# Altium project DMX8x8A-v1.PrjPcb
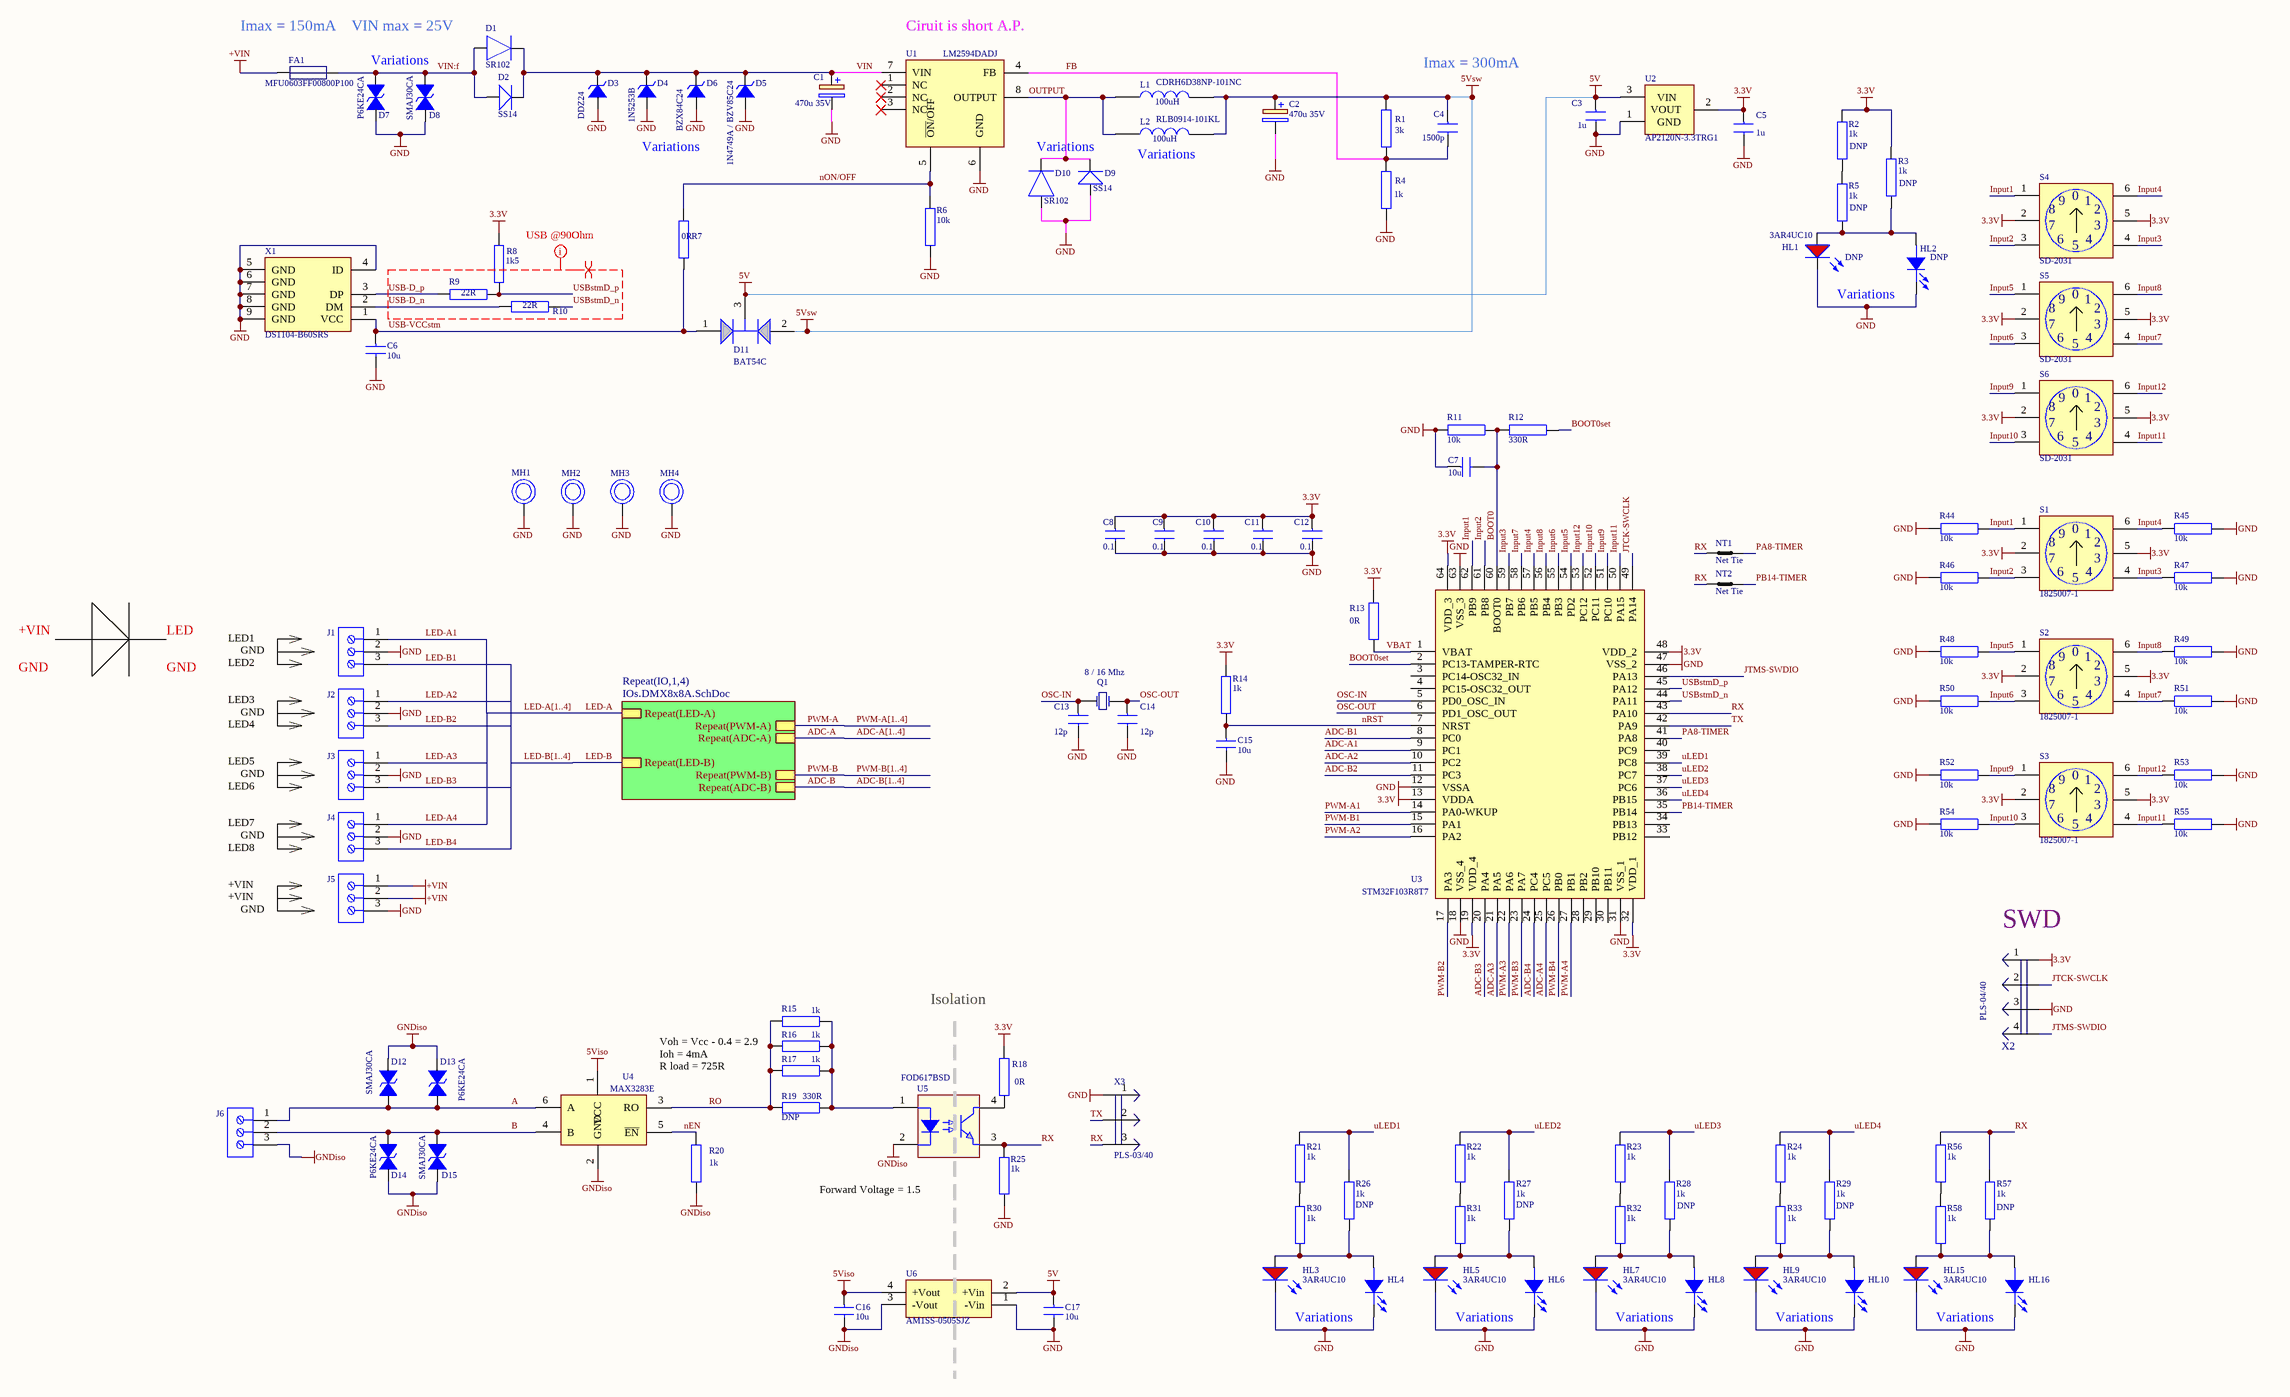
[diagram p0: Top.DMX8x8A-v1.SchDoc]
2 sheets, 255 parts. Net scope: hierarchical (ports join the sheet entries above them; power ports are global).
Board file: DMX8x8A-v1.PcbDoc
Sheets:
  Top.DMX8x8A-v1.SchDoc
    IO1 = IOs.DMX8x8A.SchDoc
    IO2 = IOs.DMX8x8A.SchDoc
    IO3 = IOs.DMX8x8A.SchDoc
    IO4 = IOs.DMX8x8A.SchDoc

## Sheet Top.DMX8x8A-v1.SchDoc: DMX8x8A-v1
size C; CheckedBy: Sitkin, Gilfanov; Author: Karabatov; CompanyName: GIKASIT; DrawnBy: Karabatov; Engineer: Karabatov; Organization: GIKASIT; Address1: 11 liniya V.O.; Address2: 32/44; Address3: Saint Petersburg; Address4: Russia; DocumentNumber: 1; SheetNumber: 1; SheetTotal: 2

### Parts
C1  value 470u 35V  [CAPPRD500W60D1025H1750]  (hidden comment: 35ZL470MEFC10X20)
C2  value 470u 35V  [CAPPRD500W60D1025H1750]  (hidden comment: 35ZL470MEFC10X20)
C3  value 1u  [Chip C 0402 - 1206]  (hidden comment: 1u 50V 5%)
C4  value 1500p  [Chip C 0402 - 1206]  (hidden comment: 1500p 25V 20%)
C5  value 1u  [Chip C 0402 - 1206]  (hidden comment: 1u 50V 5%)
C6  value 10u  [Chip C 0402 - 1206]  (hidden comment: 10u 50V 5%)
C7  value 10u  [Chip C 0402 - 1206]  (hidden comment: 10u 50V 5%)
C8  value 0.1  [Chip C 0402 - 1206]  (hidden comment: 0.1 25V 20%)
C9  value 0.1  [Chip C 0402 - 1206]  (hidden comment: 0.1 25V 20%)
C10  value 0.1  [Chip C 0402 - 1206]  (hidden comment: 0.1 25V 20%)
C11  value 0.1  [Chip C 0402 - 1206]  (hidden comment: 0.1 25V 20%)
C12  value 0.1  [Chip C 0402 - 1206]  (hidden comment: 0.1 25V 20%)
C13  value 12p  [Chip C 0402 - 1206]  (hidden comment: 12p 25V 20%)
C14  value 12p  [Chip C 0402 - 1206]  (hidden comment: 12p 25V 20%)
C15  value 10u  [Chip C 0402 - 1206]  (hidden comment: 10u 50V 5%)
C16  value 10u  [Chip C 0402 - 1206]  (hidden comment: 10u 50V 5%)
C17  value 10u  [Chip C 0402 - 1206]  (hidden comment: 10u 50V 5%)
D1  SR102  [DO-204AL (DO-41)]
D2  SS14  [DO-214AC (SMA)]
D3  DDZ24  [SOD323F]
D4  1N5253B  [DO-204AH (DO-35).SLDPRT]
D5  1N4749A / BZV85C24  [DO-204AL (DO-41)]
D6  BZX84C24  [SOT-23-3 (3)]
D7  P6KE24CA  [DIOAD1910W90L670D310 (DO-15)]
D8  SMAJ30CA  [DO-214AC (SMA) biplar]
D9  SS14  [DO-214AC (SMA)]
D10  SR102  [DO-204AL (DO-41)]
D11  BAT54C  [SOT-23-3 (3)]
D12  SMAJ30CA  [DO-214AC (SMA) biplar]
D13  P6KE24CA  [DIOAD1910W90L670D310 (DO-15)]
D14  P6KE24CA  [DIOAD1910W90L670D310 (DO-15)]
D15  SMAJ30CA  [DO-214AC (SMA) biplar]
FA1  MFU0603FF00800P100  [FUSC1608X55N]
HL1  3AR4UC10  [LED-2pin 2.54mm]
HL2  ? Any  [LED SMD 0805]  (value not drawn)
HL3  3AR4UC10  [LED-2pin 2.54mm]
HL4  ? Any  [LED SMD 0805]  (value not drawn)
HL5  3AR4UC10  [LED-2pin 2.54mm]
HL6  ? Any  [LED SMD 0805]  (value not drawn)
HL7  3AR4UC10  [LED-2pin 2.54mm]
HL8  ? Any  [LED SMD 0805]  (value not drawn)
HL9  3AR4UC10  [LED-2pin 2.54mm]
HL10  ? Any  [LED SMD 0805]  (value not drawn)
HL15  3AR4UC10  [LED-2pin 2.54mm]
HL16  ? Any  [LED SMD 0805]  (value not drawn)
J1  691134710003  [691134710003]  (value not drawn)
J2  691134710003  [691134710003]  (value not drawn)
J3  691134710003  [691134710003]  (value not drawn)
J4  691134710003  [691134710003]  (value not drawn)
J5  691134710003  [691134710003]  (value not drawn)
J6  691134710003  [691134710003]  (value not drawn)
L1  CDRH6D38NP-101NC  value 100uH  [INDPM6767X400N]
L2  RLB0914-101KL  value 100uH  [RLB0914]
MH1  PMH  [Hole Pad 3.2x4mm]  (value not drawn)  (no BOM)
MH2  PMH  [Hole Pad 3.2x4mm]  (value not drawn)  (no BOM)
MH3  PMH  [Hole Pad 3.2x4mm]  (value not drawn)  (no BOM)
MH4  PMH  [Hole Pad 3.2x4mm]  (value not drawn)  (no BOM)
NT1  Net Tie  [Net Tie 0.3]  (net tie, no BOM)
NT2  Net Tie  [Net Tie 0.3]  (net tie, no BOM)
Q1  value 8 / 16 Mhz  [HC49SMD]  (hidden comment: Crystal HC/49US SMD)
R1  value 3k  [Chip R 0402 - 1206]  (hidden comment: 3k 5%)
R2  value 1k  [Chip R 0402 - 1206]  (hidden comment: 1k 5%)
R3  value 1k  [Chip R 0402 - 1206]  (hidden comment: 1k 5%)
R4  value 1k  [Chip R 0402 - 1206]  (hidden comment: 1k 5%)
R5  value 1k  [Chip R 0402 - 1206]  (hidden comment: 1k 5%)
R6  value 10k  [Chip R 0402 - 1206]  (hidden comment: 10k 5%)
R7  0R  [Chip R 0402 - 1206]
R8  value 1k5  [Chip R 0402 - 1206]  (hidden comment: 1k5 5%)
R9  value 22R  [Chip R 0402 - 1206]  (hidden comment: 22R 5%)
R10  value 22R  [Chip R 0402 - 1206]  (hidden comment: 22R 5%)
R11  value 10k  [Chip R 0402 - 1206]  (hidden comment: 10k 5%)
R12  value 330R  [Chip R 0402 - 1206]  (hidden comment: 330R 5%)
R13  0R  [Chip R 0402 - 1206]
R14  value 1k  [Chip R 0402 - 1206]  (hidden comment: 1k 5%)
R15  value 1k  [Chip R 0402 - 1206]  (hidden comment: 1k 5%)
R16  value 1k  [Chip R 0402 - 1206]  (hidden comment: 1k 5%)
R17  value 1k  [Chip R 0402 - 1206]  (hidden comment: 1k 5%)
R18  0R  [Chip R 0402 - 1206]
R19  value 330R  [Chip R 0402 - 1206]  (hidden comment: 330R 5%)
R20  value 1k  [Chip R 0402 - 1206]  (hidden comment: 1k 5%)
R21  value 1k  [Chip R 0402 - 1206]  (hidden comment: 1k 5%)
R22  value 1k  [Chip R 0402 - 1206]  (hidden comment: 1k 5%)
R23  value 1k  [Chip R 0402 - 1206]  (hidden comment: 1k 5%)
R24  value 1k  [Chip R 0402 - 1206]  (hidden comment: 1k 5%)
R25  value 1k  [Chip R 0402 - 1206]  (hidden comment: 1k 5%)
R26  value 1k  [Chip R 0402 - 1206]  (hidden comment: 1k 5%)
R27  value 1k  [Chip R 0402 - 1206]  (hidden comment: 1k 5%)
R28  value 1k  [Chip R 0402 - 1206]  (hidden comment: 1k 5%)
R29  value 1k  [Chip R 0402 - 1206]  (hidden comment: 1k 5%)
R30  value 1k  [Chip R 0402 - 1206]  (hidden comment: 1k 5%)
R31  value 1k  [Chip R 0402 - 1206]  (hidden comment: 1k 5%)
R32  value 1k  [Chip R 0402 - 1206]  (hidden comment: 1k 5%)
R33  value 1k  [Chip R 0402 - 1206]  (hidden comment: 1k 5%)
R44  value 10k  [Chip R 0402 - 1206]  (hidden comment: 10k 5%)
R45  value 10k  [Chip R 0402 - 1206]  (hidden comment: 10k 5%)
R46  value 10k  [Chip R 0402 - 1206]  (hidden comment: 10k 5%)
R47  value 10k  [Chip R 0402 - 1206]  (hidden comment: 10k 5%)
R48  value 10k  [Chip R 0402 - 1206]  (hidden comment: 10k 5%)
R49  value 10k  [Chip R 0402 - 1206]  (hidden comment: 10k 5%)
R50  value 10k  [Chip R 0402 - 1206]  (hidden comment: 10k 5%)
R51  value 10k  [Chip R 0402 - 1206]  (hidden comment: 10k 5%)
R52  value 10k  [Chip R 0402 - 1206]  (hidden comment: 10k 5%)
R53  value 10k  [Chip R 0402 - 1206]  (hidden comment: 10k 5%)
R54  value 10k  [Chip R 0402 - 1206]  (hidden comment: 10k 5%)
R55  value 10k  [Chip R 0402 - 1206]  (hidden comment: 10k 5%)
R56  value 1k  [Chip R 0402 - 1206]  (hidden comment: 1k 5%)
R57  value 1k  [Chip R 0402 - 1206]  (hidden comment: 1k 5%)
R58  value 1k  [Chip R 0402 - 1206]  (hidden comment: 1k 5%)
S1  1825007-1  [1825007-1]
S2  1825007-1  [1825007-1]
S3  1825007-1  [1825007-1]
S4  SD-2031  [SD-2031]
S5  SD-2031  [SD-2031]
S6  SD-2031  [SD-2031]
U1  LM2594DADJ  [SOIC-8]
U2  AP2120N-3.3TRG1  [SOT-23-3 (3)]
U3  STM32F103R8T7  [LQFP64 (QFP50P1200X1200X160-64N)]
U4  MAX3283E  [SOT23-6 (SOT95P280X145-6N)]
U5  FOD617BSD  [FOD617BSD]
U6  AM1SS-0505SJZ  [AM1S]
X1  DS1104-B60SRS  [DS1104-B60SRS]
X2  PLS-04/40  [PLS-04]
X3  PLS-03/40  [PLS-03]

### Sub-sheets
Repeat(IO,1,4) = IOs.DMX8x8A.SchDoc: Repeat(LED-B), Repeat(LED-A), Repeat(PWM-A), Repeat(ADC-A), Repeat(ADC-B), Repeat(PWM-B)

### Nets
3.3V: C5.2 C8.2 C9.2 C10.2 C11.2 C12.2 R2.2 R3.2 R8.2 R13.2 R14.2 R18.2 S1.2 S1.5 S2.2 S2.5 S3.2 S3.5 S4.2 S4.5 S5.2 S5.5 S6.2 S6.5 U2.2(VOUT) U3.13(VDDA) U3.19(VDD_4) U3.32(VDD_1) U3.48(VDD_2) U3.64(VDD_3) X2.1
5V: C3.2 C17.2 D11.3(C) U2.3(VIN) U6.2(+Vin)
5Viso: C16.2 U4.1(VCC) U6.4(+Vout)
5Vsw: C2.1(+) C4.2 D11.2(K) L1.2 L2.2 R1.2
+VIN: FA1.1 J5.1 J5.2
GND: C1.2(-) C2.2(-) C3.1 C5.1 C6.1 C7.2 C8.1 C9.1 C10.1 C11.1 C12.1 C13.1 C14.1 C15.1 C17.1 D3.2(A) D4.2 D5.2 D6.1 D7.1 D8.1 D9.1 D10.1(K) HL1.2 HL2.2(K) HL3.2 HL4.2(K) HL5.2 HL6.2(K) HL7.2 HL8.2(K) HL9.2 HL10.2(K) HL15.2 HL16.2(K) J1.2 J2.2 J3.2 J4.2 J5.3 MH1.1 MH2.1 MH3.1 MH4.1 R4.1 R6.1 R11.1 R25.1 R44.1 R45.1 R46.1 R47.1 R48.1 R49.1 R50.1 R51.1 R52.1 R53.1 R54.1 R55.1 U1.6(GND) U2.1(GND) U3.12(VSSA) U3.18(VSS_4) U3.31(VSS_1) U3.47(VSS_2) U3.63(VSS_3) U6.1(-Vin) X1.4(ID) X1.5(GND) X1.6(GND) X1.7(GND) X1.8(GND) X1.9(GND) X2.3 X3.1
GNDiso: C16.1 D12.1 D13.1 D14.1 D15.1 J6.3 R20.1 U4.2(GND) U5.2(C) U6.3(-Vout)
A: D12.2 D13.2 J6.1 U4.6(A)
ADC-A: sheet Repeat(IO,1,4)/Repeat(ADC-A)
ADC-A1: U3.9(PC1)
ADC-A2: U3.10(PC2)
ADC-A3: U3.21(PA5)
ADC-A4: U3.25(PC5)
ADC-B: sheet Repeat(IO,1,4)/Repeat(ADC-B)
ADC-B1: U3.8(PC0)
ADC-B2: U3.11(PC3)
ADC-B3: U3.20(PA4)
ADC-B4: U3.24(PC4)
B: D14.2 D15.2 J6.2 U4.4(B)
BOOT0: C7.1 R11.2 R12.1 U3.60(BOOT0)
BOOT0set: R12.2 U3.2(PC13-TAMPER-RTC)
FB: C4.1 R1.1 R4.2 U1.4(FB)
Input1: R44.2 S1.1 S4.1 U3.62(PB9)
Input2: R46.2 S1.3 S4.3 U3.61(PB8)
Input3: R47.2 S1.4 S4.4 U3.59(PB7)
Input4: R45.2 S1.6 S4.6 U3.57(PB5)
Input5: R48.2 S2.1 S5.1 U3.54(PD2)
Input6: R50.2 S2.3 S5.3 U3.55(PB3)
Input7: R51.2 S2.4 S5.4 U3.58(PB6)
Input8: R49.2 S2.6 S5.6 U3.56(PB4)
Input9: R52.2 S3.1 S6.1 U3.51(PC10)
Input10: R54.2 S3.3 S6.3 U3.52(PC11)
Input11: R55.2 S3.4 S6.4 U3.50(PA15)
Input12: R53.2 S3.6 S6.6 U3.53(PC12)
JTCK-SWCLK: U3.49(PA14) X2.2
JTMS-SWDIO: U3.46(PA13) X2.4
LED-A: sheet Repeat(IO,1,4)/Repeat(LED-A)
LED-A1: J1.1
LED-A2: J2.1
LED-A3: J3.1
LED-A4: J4.1
LED-B: sheet Repeat(IO,1,4)/Repeat(LED-B)
LED-B1: J1.3
LED-B2: J2.3
LED-B3: J3.3
LED-B4: J4.3
nEN: R20.2 U4.5(~{EN})
nON/OFF: R6.2 R7.2 U1.5(~{ON}/OFF)
nRST: C15.2 R14.1 U3.7(NRST)
OSC-IN: C13.2 Q1.1 U3.5(PD0_OSC_IN)
OSC-OUT: C14.2 Q1.2 U3.6(PD1_OSC_OUT)
OUTPUT: D9.2 D10.2(A) L1.1 L2.1 U1.8(OUTPUT)
PA8-TIMER: NT1.2 U3.41(PA8)
PB14-TIMER: NT2.2 U3.35(PB14)
PWM-A: sheet Repeat(IO,1,4)/Repeat(PWM-A)
PWM-A1: U3.14(PA0-WKUP)
PWM-A2: U3.16(PA2)
PWM-A3: U3.22(PA6)
PWM-A4: U3.27(PB1)
PWM-B: sheet Repeat(IO,1,4)/Repeat(PWM-B)
PWM-B1: U3.15(PA1)
PWM-B2: U3.17(PA3)
PWM-B3: U3.23(PA7)
PWM-B4: U3.26(PB0)
RO: R15.1 R16.1 R17.1 R19.1 U4.3(RO)
RX: NT1.1 NT2.1 R25.2 R56.2 R57.2 U3.43(PA10) U5.3(E) X3.3
TX: U3.42(PA9) X3.2
uLED1: R21.2 R26.2 U3.39(PC8)
uLED2: R22.2 R27.2 U3.38(PC7)
uLED3: R23.2 R28.2 U3.37(PC6)
uLED4: R24.2 R29.2 U3.36(PB15)
USB-D_n: R10.1 X1.2(DM)
USB-D_p: R9.1 X1.3(DP)
USB-VCCstm: C6.2 D11.1(A) R7.1 X1.1(VCC)
USBstmD_n: R10.2 U3.44(PA11)
USBstmD_p: R8.1 R9.2 U3.45(PA12)
VBAT: R13.1 U3.1(VBAT)
VIN: C1.1(+) D1.2(A) D2.2 D3.1(C) D4.1 D5.1 D6.3 U1.7(VIN)
VIN:f: D1.1(K) D2.1 D7.2 D8.2 FA1.2
NetHL1_1: HL1.1 HL2.1(A) R3.1 R5.1
NetHL3_1: HL3.1 HL4.1(A) R26.1 R30.1
NetHL5_1: HL5.1 HL6.1(A) R27.1 R31.1
NetHL7_1: HL7.1 HL8.1(A) R28.1 R32.1
NetHL9_1: HL9.1 HL10.1(A) R29.1 R33.1
NetHL15_1: HL15.1 HL16.1(A) R57.1 R58.1
NetR2_1: R2.1 R5.2
NetR15_2: R15.2 R16.2 R17.2 R19.2 U5.1(A)
NetR18_1: R18.1 U5.4(C)
NetR21_1: R21.1 R30.2
NetR22_1: R22.1 R31.2
NetR23_1: R23.1 R32.2
NetR24_1: R24.1 R33.2
NetR56_1: R56.1 R58.2

Not connected (* = marked no-connect by the designer): U1 1(NC)* 2(NC)* 3(NC)*; U3 3(PC14-OSC32_IN) 4(PC15-OSC32_OUT) 28(PB2) 29(PB10) 30(PB11) 33(PB12) 34(PB13) 40(PC9)

### Buses and harness runs
bus ADC-A[1..4]
bus ADC-B[1..4]
bus LED-A[1..4]
bus LED-B[1..4]
bus PWM-A[1..4]
bus PWM-B[1..4]

### Layout directives
mark named USB @90Ohm: USB-D_n, USB-D_p, USBstmD_n, USBstmD_p
differential pair: USB-D_n, USB-D_p, USBstmD_n, USBstmD_p

### Notes on the sheet
- (near FA1) Imax = 150mA
- VIN max = 25V
- (near U1) Ciruit is short A.P.
- Variations
- Imax = 300mA
- (near L2) Variations
- (near HL2) Variations
- +VIN
- LED
- LED1
- GND
- LED2
- LED3
- LED4
- LED5
- LED6
- LED7
- LED8
- (near X2) SWD
- Isolation
- Voh = Vcc - 0.4 = 2.9
  Ioh = 4mA
  R load = 725R
- (near U5) Forward Voltage = 1.5
- (near HL4) Variations
- (near HL6) Variations
- (near HL8) Variations
- (near HL10) Variations
- (near HL16) Variations
- Title
- Size:
- Date:
- File:
- C
- Number:
- Time:
- Revision:
- Sheet
- of
- (in symbol 1825007-1) 0; 9; 8; 7
- (in symbol SD-2031) 0; 9; 8; 7

### Library data of the parts
C1 C2 = 35ZL470MEFC10X20: Radial Lead Aluminum Electrolytic Capacitors; SMD/TH: TH; HelpURL: http://www.rubycon.co.jp/en/catalog/e_pdfs/aluminum/e_zl.pdf
C3 C5 = Ceramic SMD Cap_R: Ceramic Chip Capacitor; Value2: 50V 5%; SMD/TH: SMD; ComponentLink1Description: Local Datasheet; ComponentLink1URL: V:\Libraries\Passives\RLC\Capacitors\AVXShortForm.pdf; HelpURL: https://www.mouser.com/catalog/supplier/library/AVXShortForm.pdf; Footprint: =copy(currentfootprint,2,4)
C4 C8-C14 = Ceramic SMD Cap_R: Ceramic Chip Capacitor; Value2: 25V 20%; ComponentLink1Description: Local Datasheet; ComponentLink1URL: V:\Libraries\Passives\RLC\Capacitors\AVXShortForm.pdf; HelpURL: https://www.mouser.com/catalog/supplier/library/AVXShortForm.pdf; Footprint: =copy(currentfootprint,2,4)
C6 C7 = Ceramic SMD Cap_R: Ceramic Chip Capacitor; Value2: 50V 5%; SMD/TH: SMD; Note: Not necessary; ComponentLink1Description: Local Datasheet; ComponentLink1URL: V:\Libraries\Passives\RLC\Capacitors\AVXShortForm.pdf; HelpURL: https://www.mouser.com/catalog/supplier/library/AVXShortForm.pdf; Footprint: =copy(currentfootprint,2,4)
C15-C17 = Ceramic SMD Cap_R: Ceramic Chip Capacitor; Value2: 50V 5%; SMD/TH: SMD; Note: can be 0.1u; ComponentLink1Description: Local Datasheet; ComponentLink1URL: V:\Libraries\Passives\RLC\Capacitors\AVXShortForm.pdf; HelpURL: https://www.mouser.com/catalog/supplier/library/AVXShortForm.pdf; Footprint: =copy(currentfootprint,2,4)
D1 D10 = SR102: Schottky Barrier Rectifier; SMD/TH: TH; DNP: D1; HelpURL: https://ru.mouser.com/Semiconductors/Discrete-Semiconductors/Diodes-Rectifiers/Schottky-Diodes-Rectifiers/Datasheets/_/N-awhng?keyword=SR103
D2 = SS14: Surface Mount Schottky Barrier Rectifier 1A; SMD/TH: SMD; DNP: D1; HelpURL: http://www.vishay.com/docs/88746/ss12.pdf
D3 = DDZ: Zener 0.5w SOD323F; Mfr: Diodes Incorporated; SMD/TH: SMD; Name1: 24; DNP: D3; HelpURL: https://www.diodes.com/assets/Datasheets/ds31987.pdf
D4 = 1N5253B: Zener DO-35; Mfr: ON Semi; SMD/TH: SMD; DNP: D3; HelpURL: https://www.onsemi.com/pub/Collateral/1N5221B-D.PDF
D5 = Zener DO-41: SMD/TH: TH; DNP: D3; HelpURL: https://assets.nexperia.com/documents/data-sheet/1N4728A_SER.pdf
D6 = BZX84C13LT1G: Zener regulator, 27V; Mfr: ON Semi; DNP: D3; HelpURL: https://www.onsemi.com/pub/Collateral/BZX84C2V4LT1-D.PDF; ComponentLink1Description: Local Datasheet; ComponentLink1URL: V:\Libraries\Discrete\Diodes\Doc\BZX84C2V4LT1-D.PDF
D7 D13 D14 = P6KE: TVS Axial 600W Unipolar 24V; SMD/TH: TH; DNP: D16; HelpURL: https://m.littelfuse.com/~/media/electronics/datasheets/tvs_diodes/littelfuse_tvs_diode_p6ke_datasheet.pdf.pdf
D8 D12 D15 = SMAJ30CA: TVS Uni 30V; Mfr: ST; DNP: D16; SMD/TH: SMD; HelpURL: https://www.st.com/resource/en/datasheet/smaj.pdf; ComponentLink1Description: Local Datasheet; ComponentLink1URL: V:\Libraries\Discrete\TVS\1724007.pdf
D9 = SS12: Surface Mount Schottky Barrier Rectifier 1A; SMD/TH: SMD; DNP: D1; HelpURL: http://www.vishay.com/docs/88746/ss12.pdf
D11 = BAT54C: SURFACE MOUNT SCHOTTKY BARRIER DIODE; Note: Necessary with USB; HelpURL: https://www.diodes.com/assets/Datasheets/ds11005.pdf; ComponentLink1Description: Local Datasheet; ComponentLink1URL: V:\Libraries\Discrete\Diodes\ds11005.pdf
FA1 = Fuse MFU: Thin Film Chip Fuse; SMD/TH: SMD; Note: Not necessary; HelpURL: http://www.vishay.com/docs/28747/mfuserie.pdf
HL1 = 3AR4UC10: LED 3mm Red; SMD/TH: TH; Note: Not necessary; HelpURL: http://www.triatron.ru/upload/catalog_photo/elements/pdf/006531.pdf; DNP: DNP
HL2 = LED 0805: SMD/TH: SMD; Note: Not necessary; DNP: DNP; PN: ?; Color: Any
HL3 = 3AR4UC10: LED 3mm Red; SMD/TH: TH; DNP: HL3; HelpURL: http://www.triatron.ru/upload/catalog_photo/elements/pdf/006531.pdf
HL4 HL6 HL8 HL10 = LED 0805: SMD/TH: SMD; PN: ?; Color: Any
HL5 HL7 HL9 = 3AR4UC10: LED 3mm Red; SMD/TH: TH; HelpURL: http://www.triatron.ru/upload/catalog_photo/elements/pdf/006531.pdf; DNP: DNP
HL15 = 3AR4UC10: LED 3mm Red; SMD/TH: TH; DNP: HL15; Note: Not necessary; HelpURL: http://www.triatron.ru/upload/catalog_photo/elements/pdf/006531.pdf
HL16 = LED 0805: SMD/TH: SMD; DNP: HL15; Note: Not necessary; PN: ?; Color: Any
J1-J6 = 691134710003: WR-TBL Serie 1347 Horizontal Cable Entry, Pressure Clamp, pitch 5mm, 3p; Compliance: Lead free / RoHS; SMD/TH: TH; Modularity: Yes; PCB/Cable/Panel: PCB; Pin Number: 3; Rated Current [UL]: 16A; Working Voltage [UL]: 300VAC; ComponentLink1Description: Manufacturer; ComponentLink1URL: http://www.we-online.de; ComponentLink2URL: https://katalog.we-online.de/em/datasheet/691134710003.pdf; ComponentLink2Description: Datasheet; Part Number: 691134710003; Packaging: Box; Operating Temperature: -30 to +120degC; Pitch: 5mm; Published Date: October 2019; Type: Horizontal; Publisher: Wurth Elektronik; Application: Pressure Clamp; HelpURL: https://www.we-online.de/katalog/datasheet/691134710003.pdf
L1 = CDRH6D38NP: SMD Power Inductor 100uH 0.65A 265mOhms; Mfr: Sumida; DNP: L1; HelpURL: http://products.sumida.com/products/pdf/CDRH6D38.pdf; SMD/TH: SMD
L2 = RLB0914-101KL: Radial Fixed Through Hole Inductor 100uH Bourns 100 uH +/-10%; SMD/TH: TH; DNP: L1; HelpURL: https://www.bourns.com/pdfs/rlb.pdf
MH1-MH4 = PMH: Plated Mounting Hole
Q1 = Crystal HC49SMD: HC/49US (AT49) LOW PROFILE SURFACE / MOUNT MICROPROCESSOR CRYSTAL; HelpURL: https://abracon.com/Resonators/ABLS2.pdf
R1 R4 R6 R11 R13-R33 R44-R56 R58 = SMD Res_R: Chip Resistor; HelpURL: http://www.vishay.com/docs/49252/_dbr_smd_resistor_product_overview_vmn_sg2189_1705.pdf; ComponentLink1Description: Local Datasheet; ComponentLink1URL: V:\Libraries\Passives\Resistors\_dbr_smd_resistor_product_overview_vmn_sg2189_1705.pdf; Footprint: =copy(currentfootprint,2,4)
  R1 R4 R6 R11 R14-R17 R20-R25 R30-R33 R44-R56 R58: Value2: 5%
  R13 R18: Value: 0R
  R19 R26-R29: DNP: DNP; Value2: 5%
R2 R3 R5 R7-R10 R12 R57 = SMD Res_R: Chip Resistor; Note: Not necessary; HelpURL: http://www.vishay.com/docs/49252/_dbr_smd_resistor_product_overview_vmn_sg2189_1705.pdf; ComponentLink1Description: Local Datasheet; ComponentLink1URL: V:\Libraries\Passives\Resistors\_dbr_smd_resistor_product_overview_vmn_sg2189_1705.pdf; Footprint: =copy(currentfootprint,2,4)
  R2 R3 R5 R57: DNP: DNP; Value2: 5%
  R7: Value: 0R
  R8-R10 R12: Value2: 5%
S1-S3 = 1825007-1: Alcoswitch DIP, Rotary Switches, 10 Positions, Flush Actuator Style, Rotary Switch Style, Rotary DIP Switch Type, 10 Switches, Thermoplastic, Sealed; SMD/TH: TH; DNP: S4; HelpURL: https://www.te.com/commerce/DocumentDelivery/DDEController?Action=showdoc&DocId=Customer+Drawing%7F1825007%7FA5%7Fpdf%7FEnglish%7FENG_CD_1825007_A5.pdf%7F1825007-1
S4-S6 = SD-2031: ROTARY CODED SWITCHES; SMD/TH: TH; DNP: S4; HelpURL: https://www.nidec-copal-electronics.com/e/catalog/switch/sd-1000&sd-2000.pdf
U1 = LM2594DADJ: 0.5 A, Step-Down Switching Regulator; Mfr: ON Semiconductor; SMD/TH: SMD; HelpURL: http://www.onsemi.com/pub/Collateral/LM2594-D.PDF
U2 = AP2120N-3.3TRG1: High Speed, Extremely Low Noise LDO Regulator; Manufacturer_Name: Diodes Inc.; Allied_Number: 70550990; SMD/TH: SMD; Datasheet Link: https://componentsearchengine.com/Datasheets/1/AP2120N-3.3TRG1.pdf; Height: 1.2mm; Manufacturer_Part_Number: AP2120N-3.3TRG1; Mouser Part Number: 621-AP2120N-3.3TRG1; Mouser Price/Stock: https://www.mouser.com/Search/Refine.aspx?Keyword=621-AP2120N-3.3TRG1; RS Part Number: 8287334P; RS Price/Stock: http://uk.rs-online.com/web/p/products/8287334P; Allied Price/Stock: https://www.alliedelec.com/diodesinc-ap2120n-3-3trg1/70550990/; HelpURL: https://www.diodes.com/assets/Datasheets/AP2120.pdf
U3 = STM32F103R8T7: Medium-density performance line ARM®-based 32-bit MCU with 64 or 128 KB Flash, USB, CAN, 7 timers, 2 ADCs, 9 com. interfaces; Mfr: STMicroelectronics; SMD/TH: SMD; Height: 1.6mm; HelpURL: https://www.st.com/resource/en/datasheet/stm32f103r8.pdf; ComponentLink1Description: Reference Manual; ComponentLink1URL: https://www.st.com/resource/en/reference_manual/cd00171190-stm32f101xx-stm32f102xx-stm32f103xx-stm32f105xx-and-stm32f107xx-advanced-arm-based-32-bit-mcus-stmicroelectronics.pdf
U4 = MAX3283E: 15kV ESD-Protected 52Mbps, 3V to 5.5V, / SOT23 RS-485/RS-422 True Fail-Safe Receiver; Manufacturer_Name: Maxim Integrated; Manufacturer_Part_Number: MAX3283EAUT+T; SMD/TH: SMD; Datasheet Link: https://datasheets.maximintegrated.com/en/ds/MAX3280E-MAX3284E.pdf; Height: 1.45mm; Mouser Part Number: 700-MAX3283EAUTT; Mouser Price/Stock: https://www.mouser.com/Search/Refine.aspx?Keyword=700-MAX3283EAUTT; RS Part Number: 9237298; RS Price/Stock: https://uk.rs-online.com/web/p/products/9237298; HelpURL: https://datasheets.maximintegrated.com/en/ds/MAX3280E-MAX3284E.pdf
U5 = FOD617BSD: 4-Pin High Operating Temperature / Phototransistor Optocouplers; Manufacturer_Name: ON Semiconductor; Manufacturer_Part_Number: FOD814; SMD/TH: TH; Datasheet Link: http://www.onsemi.com/pub/Collateral/FOD814-D.PDF; Height: 4.4mm; Mouser Part Number: 512-FOD814; Mouser Price/Stock: https://www.mouser.com/Search/Refine.aspx?Keyword=512-FOD814; RS Part Number: 7599311P; RS Price/Stock: http://uk.rs-online.com/web/p/products/7599311P; HelpURL: https://4donline.ihs.com/images/VipMasterIC/IC/FAIR/FAIRS24026/FAIRS24026-1.pdf?hkey=EC6BD57738AE6E33B588C5F9AD3CEFA7
U6 = AM1SS-0505SJZ: Isolated DC-DC Converter 1 Watt; Manufacturer_Name: aimtec; Manufacturer_Part_Number: AM1SS-1205S-NZ; SMD/TH: SMD; Datasheet Link: http://www.aimtec.com/site/Aimtec/files/Datasheet/HighResolution/am1ss-nz.pdf; Height: 10.16mm; HelpURL: http://www.aimtec.com/site/Aimtec/files/Datasheet/HighResolution/am1ss-nz.pdf
X1 = miniUSB: mini USB on PCB; Note: Not necessary; HelpURL: https://static.chipdip.ru/lib/028/DOC001028880.pdf
X2 = PLS-04: Pin header, Vertcial, Strips, Male, 2.54mm pitch; Mfr: Бурый медведь; SMD/TH: TH; PN: PLS-04/40; HelpURL: Y:\LIBRARY\Altium Designer\Datasheets\Connectors\00789-Штыревые разъемы Платан.pdf
X3 = PLS-03: PCB 2.54 PLS 03 Header; Mfr: Бурый медведь; PN: PLS-03/40; HelpURL: Y:\LIBRARY\Altium Designer\Datasheets\Connectors\00789-Штыревые разъемы Платан.pdf

## Sheet IOs.DMX8x8A.SchDoc: DMX8x8A-v1
size A; ApprovedBy: Фамилия4; CheckedBy: Фамилия2; Author: Фамилия1; DocumentNumber: 2; SheetNumber: 2; SheetTotal: 2; NormInspection: Фамилия3; DocumentType1str: Схема; DocumentType2str: электрическая принципиальная
Used 4 times, as channels IO1, IO2, IO3, IO4. Parts and nets are listed once, with the designators drawn on the sheet.
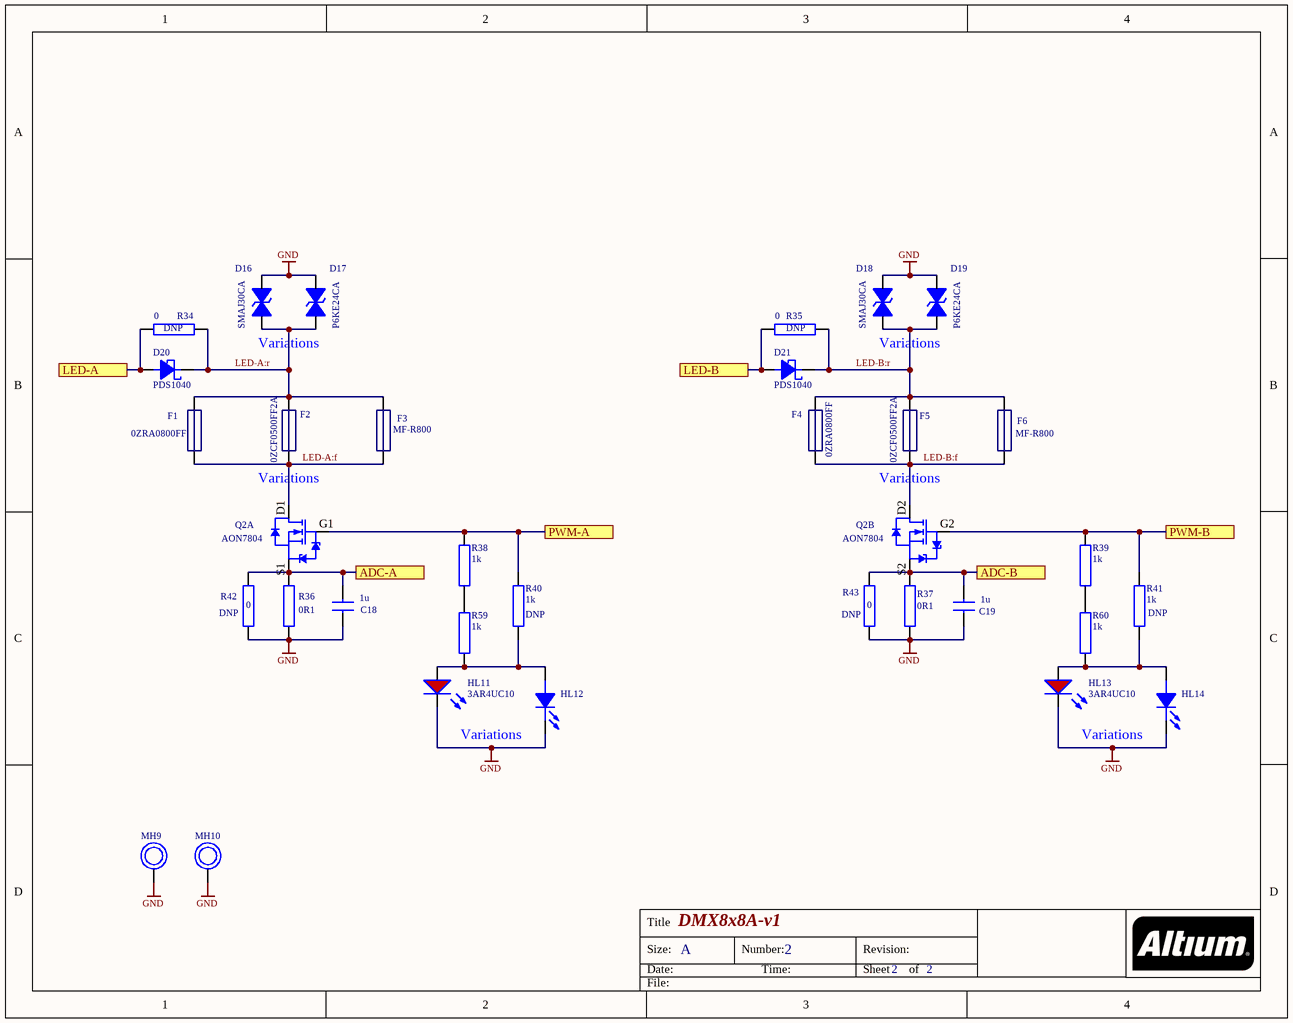
[diagram p1: IOs.DMX8x8A.SchDoc]

### Parts
C18  value 1u  [Chip C 0402 - 1206]  (hidden comment: 1u 50V 5%)
C19  value 1u  [Chip C 0402 - 1206]  (hidden comment: 1u 50V 5%)
D16  SMAJ30CA  [DO-214AC (SMA) biplar]
D17  P6KE24CA  [DIOAD1910W90L670D310 (DO-15)]
D18  SMAJ30CA  [DO-214AC (SMA) biplar]
D19  P6KE24CA  [DIOAD1910W90L670D310 (DO-15)]
D20  PDS1040  [PDS1040]
D21  PDS1040  [PDS1040]
F1  0ZRA0800FF  [0ZRA0800FF]
F2  0ZCF0500FF2A  [0ZCF0500FF2A]
F3  MF-R800  [MF-R800]
F4  0ZRA0800FF  [0ZRA0800FF]
F5  0ZCF0500FF2A  [0ZCF0500FF2A]
F6  MF-R800  [MF-R800]
HL11  3AR4UC10  [LED-2pin 2.54mm]
HL12  ? Any  [LED SMD 0805]  (value not drawn)
HL13  3AR4UC10  [LED-2pin 2.54mm]
HL14  ? Any  [LED SMD 0805]  (value not drawn)
MH9  PMH  [Hole Pad 3.2x4mm]  (value not drawn)  (no BOM)
MH10  PMH  [Hole Pad 3.2x4mm]  (value not drawn)  (no BOM)
Q2  AON7804  [AON7804]  (parts A,B of 2)
R34  value 0  [Chip R 0402 - 1206]  (hidden comment: 0 5%)
R35  value 0  [Chip R 0402 - 1206]  (hidden comment: 0 5%)
R36  value 0R1  [RES7W]  (hidden comment: KNP700JB-91-0R1)
R37  value 0R1  [RES7W]  (hidden comment: KNP700JB-91-0R1)
R38  value 1k  [Chip R 0402 - 1206]  (hidden comment: 1k 5%)
R39  value 1k  [Chip R 0402 - 1206]  (hidden comment: 1k 5%)
R40  value 1k  [Chip R 0402 - 1206]  (hidden comment: 1k 5%)
R41  value 1k  [Chip R 0402 - 1206]  (hidden comment: 1k 5%)
R42  value 0  [Chip R 0402 - 1206]  (hidden comment: 0 5%)
R43  value 0  [Chip R 0402 - 1206]  (hidden comment: 0 5%)
R59  value 1k  [Chip R 0402 - 1206]  (hidden comment: 1k 5%)
R60  value 1k  [Chip R 0402 - 1206]  (hidden comment: 1k 5%)

### Ports
ADC-A, ADC-B, LED-A, LED-B, PWM-A, PWM-B

### Nets
GND: C18.1 C19.1 D16.1 D17.1 D18.1 D19.1 HL11.2 HL12.2(K) HL13.2 HL14.2(K) MH9.1 MH10.1 R36.1 R37.1 R42.1 R43.1
ADC-A: C18.2 Q2.S1 R36.2 R42.2 ; port ADC-A
ADC-B: C19.2 Q2.S2(S1) R37.2 R43.2 ; port ADC-B
LED-A: D20.1(A) R34.2 ; port LED-A
LED-A:f: F1.1 F2.1 F3.1 Q2.D1
LED-A:r: D16.2 D17.2 D20.2(K) F1.2 F2.2 F3.2 R34.1
LED-B: D21.1(A) R35.2 ; port LED-B
LED-B:f: F4.1 F5.1 F6.1 Q2.D2
LED-B:r: D18.2 D19.2 D21.2(K) F4.2 F5.2 F6.2 R35.1
PWM-A: Q2.G1 R38.1 R40.1 ; port PWM-A
PWM-B: Q2.G2(G1) R39.1 R41.1 ; port PWM-B
NetHL11_1: HL11.1 HL12.1(A) R40.2 R59.2
NetHL13_1: HL13.1 HL14.1(A) R41.2 R60.2
NetR38_2: R38.2 R59.1
NetR39_2: R39.2 R60.1

### Channels
IO1: designators end in :IO1; ports ADC-A=ADC-A1 ADC-B=ADC-B1 LED-A=LED-A1 LED-B=LED-B1 PWM-A=PWM-A1 PWM-B=PWM-B1
IO2: designators end in :IO2; ports ADC-A=ADC-A2 ADC-B=ADC-B2 LED-A=LED-A2 LED-B=LED-B2 PWM-A=PWM-A2 PWM-B=PWM-B2
IO3: designators end in :IO3; ports ADC-A=ADC-A3 ADC-B=ADC-B3 LED-A=LED-A3 LED-B=LED-B3 PWM-A=PWM-A3 PWM-B=PWM-B3
IO4: designators end in :IO4; ports ADC-A=ADC-A4 ADC-B=ADC-B4 LED-A=LED-A4 LED-B=LED-B4 PWM-A=PWM-A4 PWM-B=PWM-B4

### Notes on the sheet
- Variations
- (near HL12) Variations
- (near HL14) Variations
- Title
- Size:
- Date:
- A
- Number:
- Time:
- Revision:
- Sheet
- of
- File:

### Library data of the parts
C18 C19 = Ceramic SMD Cap_R: as C3 on sheet Top.DMX8x8A-v1; ComponentLink1Description: Local Datasheet; ComponentLink1URL: V:\Libraries\Passives\RLC\Capacitors\AVXShortForm.pdf; HelpURL: https://www.mouser.com/catalog/supplier/library/AVXShortForm.pdf; Footprint: =copy(currentfootprint,2,4)
D16 D18 = SMAJ30CA: as D8 on sheet Top.DMX8x8A-v1; HelpURL: https://www.st.com/resource/en/datasheet/smaj.pdf; ComponentLink1Description: Local Datasheet; ComponentLink1URL: V:\Libraries\Discrete\TVS\1724007.pdf
D17 D19 = P6KE: as D7 on sheet Top.DMX8x8A-v1; HelpURL: https://m.littelfuse.com/~/media/electronics/datasheets/tvs_diodes/littelfuse_tvs_diode_p6ke_datasheet.pdf.pdf
D20 D21 = PDS1040: 10A SCHOTTKY BARRIER RECTIFIER; Mfr: DIODES INC.; HelpURL: https://www.diodes.com/assets/Datasheets/Ds30538.pdf
F1 F4 = 0ZRA: Radial Leaded PTC 8/13.6A; SMD/TH: TH; DNP: F1; IH/IT: 5/13.6A; HelpURL: https://www.belfuse.com/resources/datasheets/circuitprotection/ds-cp-0zra-series.pdf
F2 F5 = 0ZCF0500FF2A: Surface Mount PTC 5/10A; SMD/TH: SMD; DNP: F1; IH/IT: 5/10; HelpURL: https://www.belfuse.com/resources/datasheets/circuitprotection/ds-cp-0zcf-series.pdf
F3 F6 = MF-R800: PTC Resettable Fuse 8/16A; SMD/TH: TH; DNP: F1; HelpURL: https://www.bourns.com/docs/Product-Datasheets/mfr.pdf; IH/IT: 8/16A
HL11 = 3AR4UC10: LED 3mm Red; SMD/TH: TH; DNP: HL11; HelpURL: http://www.triatron.ru/upload/catalog_photo/elements/pdf/006531.pdf
HL12 = LED 0805: SMD/TH: SMD; DNP: HL11; PN: ?; Color: Any
HL13 = 3AR4UC10: LED 3mm Red; SMD/TH: TH; DNP: HL13; HelpURL: http://www.triatron.ru/upload/catalog_photo/elements/pdf/006531.pdf
HL14 = LED 0805: SMD/TH: SMD; DNP: HL13; PN: ?; Color: Any
MH9 MH10 = PMH: Plated Mounting Hole
Q2 = AON7804: 30V Dual N-Channel MOSFET; SMD/TH: SMD; HelpURL: http://aosmd.com/res/data_sheets/AON7804.pdf; ComponentLink1Description: Drawing; ComponentLink1URL: http://aosmd.com/res/packaging_information/DFN3x3_8L_EP2_P.pdf
R34 R35 R38-R43 R59 R60 = SMD Res_R: Chip Resistor; HelpURL: http://www.vishay.com/docs/49252/_dbr_smd_resistor_product_overview_vmn_sg2189_1705.pdf; ComponentLink1Description: Local Datasheet; ComponentLink1URL: V:\Libraries\Passives\Resistors\_dbr_smd_resistor_product_overview_vmn_sg2189_1705.pdf; Value2: 5%; Footprint: =copy(currentfootprint,2,4)
  R34 R35 R40-R43: DNP: DNP
R36 R37 = Res 7W: Resistor 7W Axial; Mfr: Yageo; SMD/TH: TH; HelpURL: https://www.yageo.com/upload/media/product/products/datasheet/lr/Yageo_LR_KNP_1.pdf

## Nets that join several sheets
GND: Top.DMX8x8A-v1 (76 pins), IO1 (16 pins), IO2 (16 pins), IO3 (16 pins), IO4 (16 pins)
ADC-A1: Top.DMX8x8A-v1 (U3.9), IO1 (C18:IO1.2 Q2:IO1.S1 R36:IO1.2 R42:IO1.2)
ADC-A2: Top.DMX8x8A-v1 (U3.10), IO2 (C18:IO2.2 Q2:IO2.S1 R36:IO2.2 R42:IO2.2)
ADC-A3: Top.DMX8x8A-v1 (U3.21), IO3 (C18:IO3.2 Q2:IO3.S1 R36:IO3.2 R42:IO3.2)
ADC-A4: Top.DMX8x8A-v1 (U3.25), IO4 (C18:IO4.2 Q2:IO4.S1 R36:IO4.2 R42:IO4.2)
ADC-B1: Top.DMX8x8A-v1 (U3.8), IO1 (C19:IO1.2 Q2:IO1.S2 R37:IO1.2 R43:IO1.2)
ADC-B2: Top.DMX8x8A-v1 (U3.11), IO2 (C19:IO2.2 Q2:IO2.S2 R37:IO2.2 R43:IO2.2)
ADC-B3: Top.DMX8x8A-v1 (U3.20), IO3 (C19:IO3.2 Q2:IO3.S2 R37:IO3.2 R43:IO3.2)
ADC-B4: Top.DMX8x8A-v1 (U3.24), IO4 (C19:IO4.2 Q2:IO4.S2 R37:IO4.2 R43:IO4.2)
LED-A1: Top.DMX8x8A-v1 (J1.1), IO1 (D20:IO1.1 R34:IO1.2)
LED-A2: Top.DMX8x8A-v1 (J2.1), IO2 (D20:IO2.1 R34:IO2.2)
LED-A3: Top.DMX8x8A-v1 (J3.1), IO3 (D20:IO3.1 R34:IO3.2)
LED-A4: Top.DMX8x8A-v1 (J4.1), IO4 (D20:IO4.1 R34:IO4.2)
LED-B1: Top.DMX8x8A-v1 (J1.3), IO1 (D21:IO1.1 R35:IO1.2)
LED-B2: Top.DMX8x8A-v1 (J2.3), IO2 (D21:IO2.1 R35:IO2.2)
LED-B3: Top.DMX8x8A-v1 (J3.3), IO3 (D21:IO3.1 R35:IO3.2)
LED-B4: Top.DMX8x8A-v1 (J4.3), IO4 (D21:IO4.1 R35:IO4.2)
PWM-A1: Top.DMX8x8A-v1 (U3.14), IO1 (Q2:IO1.G1 R38:IO1.1 R40:IO1.1)
PWM-A2: Top.DMX8x8A-v1 (U3.16), IO2 (Q2:IO2.G1 R38:IO2.1 R40:IO2.1)
PWM-A3: Top.DMX8x8A-v1 (U3.22), IO3 (Q2:IO3.G1 R38:IO3.1 R40:IO3.1)
PWM-A4: Top.DMX8x8A-v1 (U3.27), IO4 (Q2:IO4.G1 R38:IO4.1 R40:IO4.1)
PWM-B1: Top.DMX8x8A-v1 (U3.15), IO1 (Q2:IO1.G2 R39:IO1.1 R41:IO1.1)
PWM-B2: Top.DMX8x8A-v1 (U3.17), IO2 (Q2:IO2.G2 R39:IO2.1 R41:IO2.1)
PWM-B3: Top.DMX8x8A-v1 (U3.23), IO3 (Q2:IO3.G2 R39:IO3.1 R41:IO3.1)
PWM-B4: Top.DMX8x8A-v1 (U3.26), IO4 (Q2:IO4.G2 R39:IO4.1 R41:IO4.1)

## Assembly variants
First assembly: not fitted C6 C7 D1 D3 D5 D6 D8 D10 D11 D12 D15 D16:IO1 D16:IO2 D16:IO3 D16:IO4 D18:IO1 D18:IO2 D18:IO3 D18:IO4 F2:IO1 F2:IO2 F2:IO3 F2:IO4 F3:IO1 F3:IO2 F3:IO3 F3:IO4 F5:IO1 F5:IO2 F5:IO3 F5:IO4 F6:IO1 F6:IO2 F6:IO3 F6:IO4 FA1 HL1 HL2 HL3 HL5 HL7 HL9 HL12:IO1 HL12:IO2 HL12:IO3 HL12:IO4 HL14:IO1 HL14:IO2 HL14:IO3 HL14:IO4 HL15 HL16 L2 R2 R3 R5 R7 R8 R9 R10 R12 R19 R26 R27 R28 R29 R34:IO1 R34:IO2 R34:IO3 R34:IO4 R35:IO1 R35:IO2 R35:IO3 R35:IO4 R40:IO1 R40:IO2 R40:IO3 R40:IO4 R41:IO1 R41:IO2 R41:IO3 R41:IO4 R42:IO1 R42:IO2 R42:IO3 R42:IO4 R43:IO1 R43:IO2 R43:IO3 R43:IO4 R56 R57 R58 S1 S2 S3 X1 X3